# EAGLE design untitled (EAGLE 9.6.2)
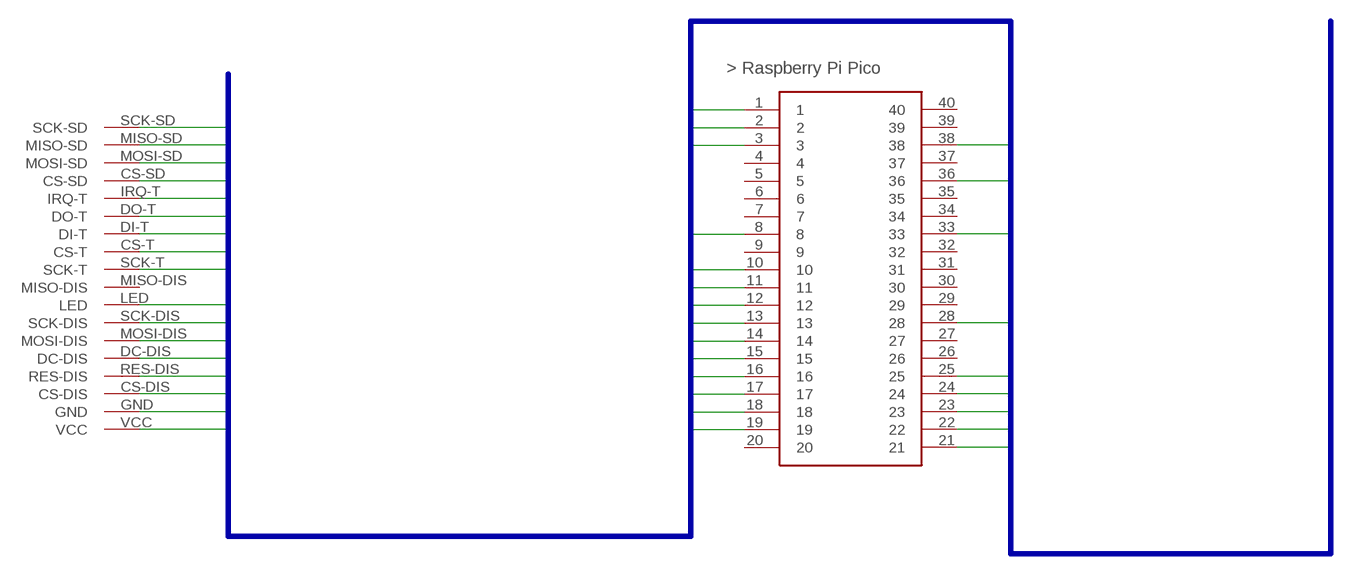
[diagram p0: schematic, sheet 1]

## Parts
U$1  ST7789  [TFT-2.8-SD]
U$3  PICO  [PICO_TH]

## Nets
3V: U$1.LED U$1.VCC U$3.36
CS-DIS: U$1.CS-DIS U$3.12
CS-SD: U$1.CS-SD U$3.22
CS-T: U$1.CS-T U$3.17
DC-DIS: U$1.DC-DIS U$3.11
GND: U$1.GND U$3.3 U$3.8 U$3.13 U$3.18 U$3.23 U$3.28 U$3.33 U$3.38
IRQ-T: U$1.IRQ-T U$3.19
MISO-DIS: U$1.DO-T U$3.16
MISO-SD: U$1.MISO-SD U$3.21
MOSI-DIS: U$1.DI-T U$1.MOSI-DIS U$3.15
MOSI-SD: U$1.MOSI-SD U$3.25
RES-DIS: U$1.RES-DIS U$3.10
RX: U$3.2
SCK-DIS: U$1.SCK-DIS U$1.SCK-T U$3.14
SCK-SD: U$1.SCK-SD U$3.24
TX: U$3.1
Unconnected: U$1.MISO-DIS U$3.4 U$3.5 U$3.6 U$3.7 U$3.9 U$3.20 U$3.26 U$3.27 U$3.29 U$3.30 U$3.31 U$3.32 U$3.34 U$3.35 U$3.37 U$3.39 U$3.40

## Buses
3V,5V,12V,CS-DIS,CS-SD,CS-T,D0-T,DC-DIS,DI-T,EN,GND,IRQ-T,LED,MISO-DIS,MISO-SD,MOSI-DIS,MOSI-SD,PWM,RES-DIS,RX,SCK-DIS,SCK-SD,TX,XA+,XA-,XB+,XB-,X-DIR,X-STEP,YA+,YA-,YB+,YB-,Y-DIR,Y-STEP

## Library data of the parts
U$1 = adafruit:ST7789
U$3 = pipico:PICO

## Board
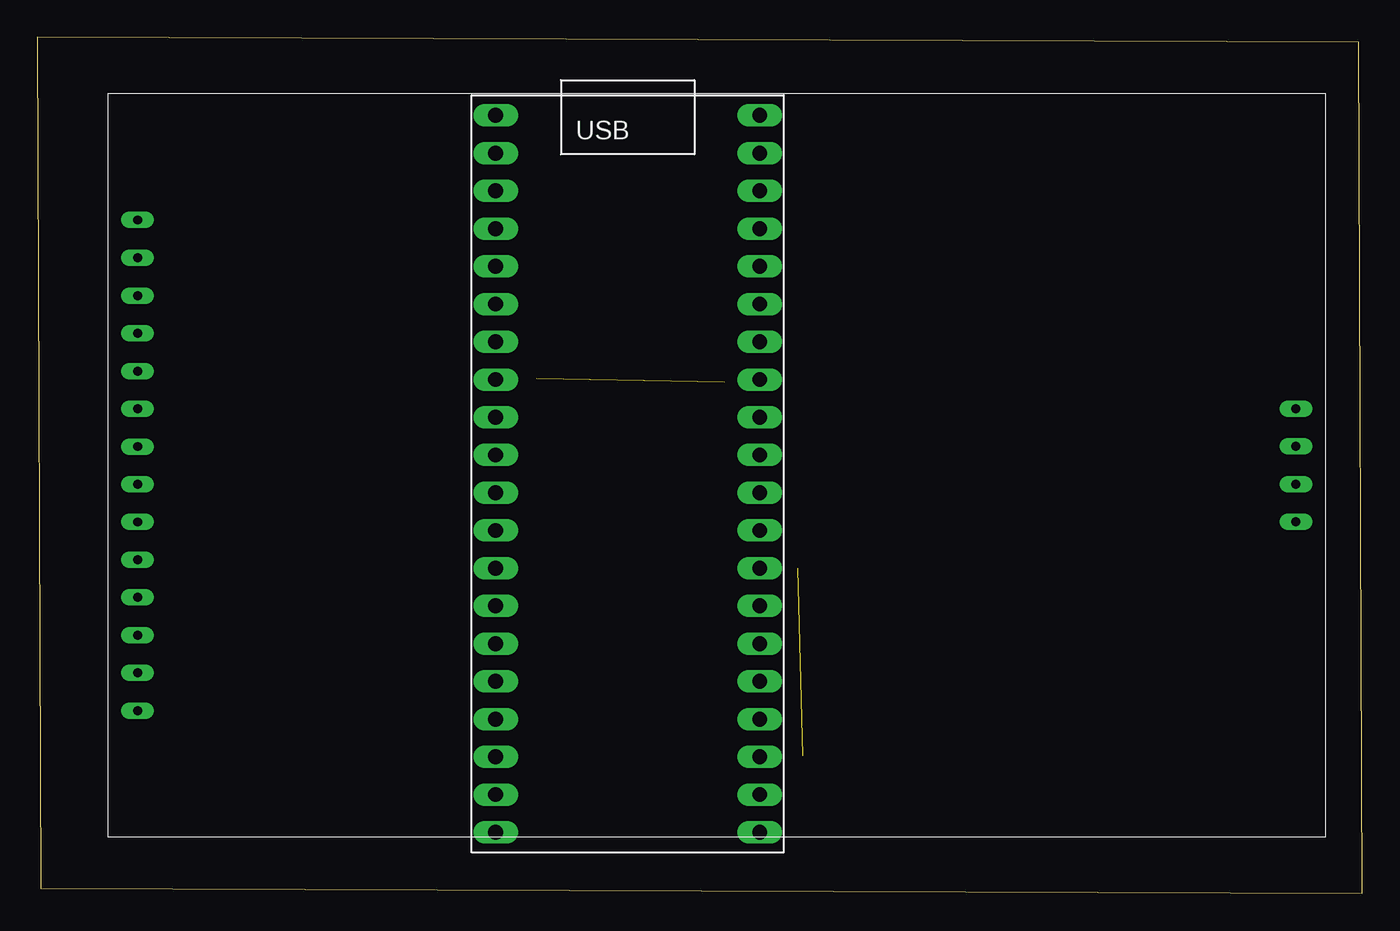
[diagram p1: board, top side]
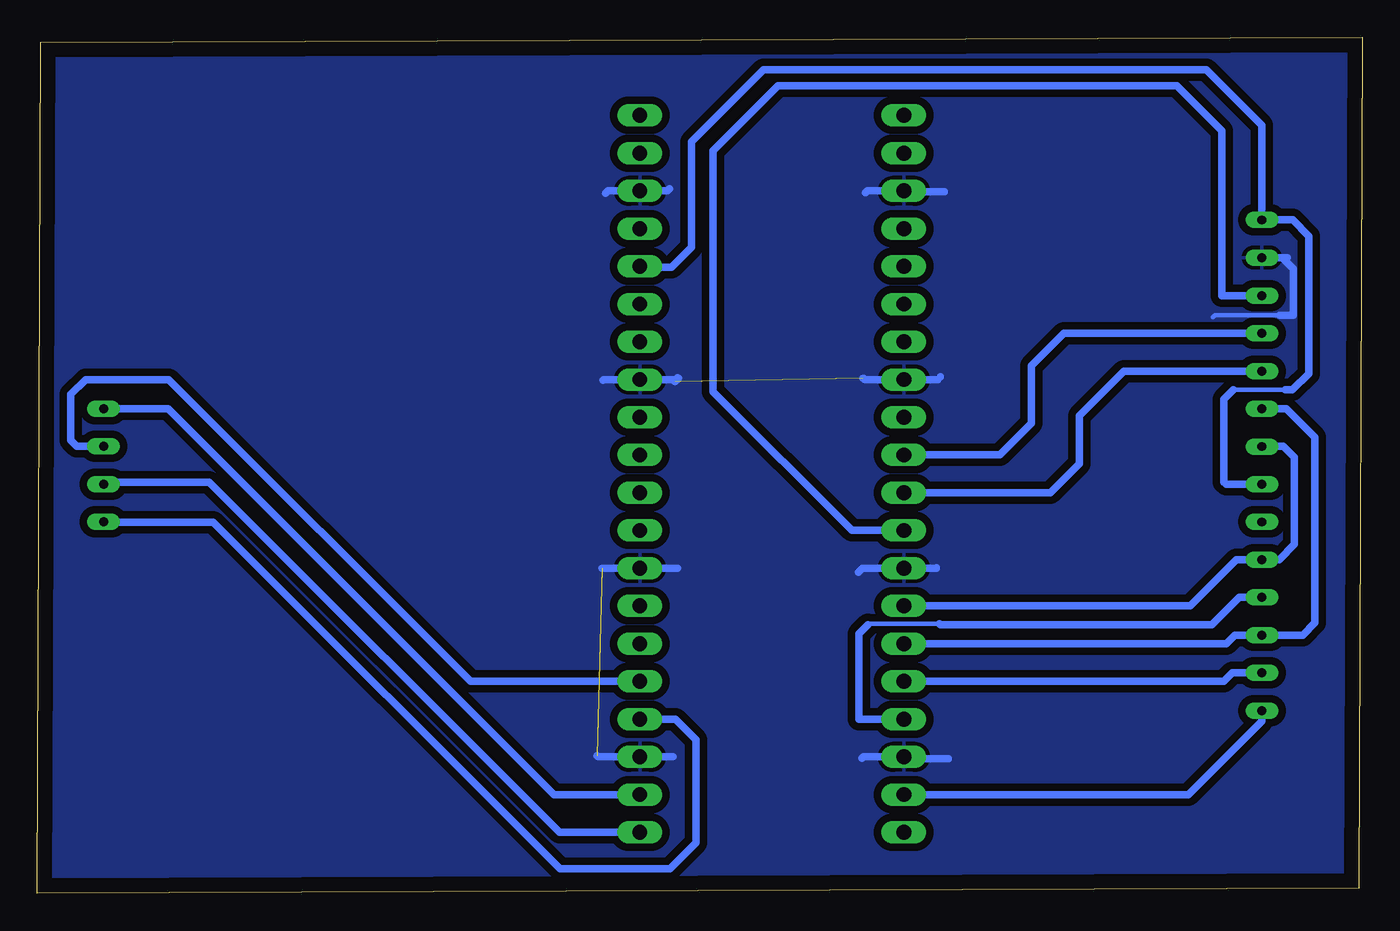
[diagram p2: board, bottom side, seen from below]

Size 89.25 x 57.65 mm. Coordinates in mm from the lower left corner, seen from the top.
Outline: 0.26,0.35 89.25,0 88.99,57.3 0,57.65 0.26,0.35
Copper layers (1*16): Top 0.035mm / dielectric 1.5mm / Bottom 0.035mm
Design rules "default *": minimum track width 6mil, minimum drill 0.35mm, track to track 20mil, track to pad 40mil, pad to pad 6mil, via to via 6mil, smd to smd 6mil, copper to edge 40mil, drill to drill 6mil, minimum pad ring 10mil, minimum via ring 8mil, stop-mask expansion 4mil, vias tented up to drill 0mil, thermal gap 10mil

### Footprints (pad centres in the part's own frame; a part is rotated, then mirrored left to right if it is on the bottom)
TFT-2.8-SD = drill 0.6 long: CS-DIS 13.58,2; CS-SD 21.19,80; CS-T 33.9,2; DC-DIS 18.66,2; DI-T 36.44,2; DO-T 38.98,2; GND 11.03,2; IRQ-T 41.52,2; LED 26.28,2; MISO-DIS 28.82,2; MISO-SD 26.27,80; MOSI-DIS 21.2,2; MOSI-SD 23.73,80; RES-DIS 16.12,2; SCK-DIS 23.74,2; SCK-SD 28.81,80; SCK-T 31.36,2; VCC 8.49,2
PICO_TH = drill 1 long: 1 -8.55,24.03; 2 -8.55,21.49; 3 -8.55,18.95; 4 -8.55,16.41; 5 -8.55,13.87; 6 -8.55,11.33; 7 -8.55,8.79; 8 -8.55,6.25; 9 -8.55,3.71; 10 -8.55,1.17; 11 -8.55,-1.37; 12 -8.55,-3.91; 13 -8.55,-6.45; 14 -8.55,-8.99; 15 -8.55,-11.53; 16 -8.55,-14.07; 17 -8.55,-16.61; 18 -8.55,-19.15; 19 -8.55,-21.69; 20 -8.55,-24.23; 21 9.23,-24.23; 22 9.23,-21.69; 23 9.23,-19.15; 24 9.23,-16.61; 25 9.23,-14.07; 26 9.23,-11.53; 27 9.23,-8.99; 28 9.23,-6.45; 29 9.23,-3.91; 30 9.23,-1.37; 31 9.23,1.17; 32 9.23,3.71; 33 9.23,6.25; 34 9.23,8.79; 35 9.23,11.33; 36 9.23,13.87; 37 9.23,16.41; 38 9.23,18.95; 39 9.23,21.49; 40 9.23,24.03

### Placement (x,y rotation side)
U$1  4.77,53.83 270 top
U$3  39.43,28.35 0 top

### Tracks (layer width: path | path; a pad name or v marks a point on that pad's centre or on a via)
3V
  Bottom 0.305: 8.68,33.9 5.2,33.9
  Bottom 0.508: U$3.36 48.59,42.15 46.54,42.15 45.19,43.5 45.19,50.61 40.35,55.45 10.51,55.45 6.77,51.71 U$1.VCC 4.7,45.34 3.62,44.26 3.62,35 4.72,33.9 5.2,33.9 | U$1.LED 9.18,27.55 9.32,27.69 9.32,33.26 8.68,33.9
CS-DIS
  Bottom 0.508: U$3.12 34.37,24.44 43.72,33.79 43.72,50 39.35,54.37 12.48,54.37 9.46,51.35 9.46,40.25 U$1.CS-DIS
CS-SD
  Bottom 0.508: U$3.22 54.45,6.66 80.43,32.64 U$1.CS-SD
CS-T
  Bottom 0.305: 28.47,18.15 29.62,18.15 33.24,18.15 33.3,18.09
  Bottom 0.508: U$1.CS-T 8.29,19.93 10.13,18.09 28.41,18.09 28.47,18.15 | U$3.17 33.91,11.74 33.91,17.48 33.3,18.09
DC-DIS
  Bottom 0.508: U$1.DC-DIS 16.05,35.17 19.05,32.17 19.05,28.93 21,26.98 U$3.11
GND  (2 unrouted)
  Bottom 0.305: 10.07,38.79 9.93,38.93 5.57,38.93
  Bottom 0.508: 33.94,21.64 33.68,21.9 U$3.13 28.69,21.9 28.67,21.92 | 33.71,9.1 33.61,9.2 U$3.18 30.75,9.07 27.89,9.07 | 51.55,9.28 51.47,9.2 U$3.23 46.44,9.2 | 6.8,42.83 U$1.GND 5.39,42.8 | 5.39,42.8 5.07,42.8 | 33.45,47.19 33.34,47.3 U$3.3 30.82,47.24 28.15,47.24 | 46.65,47.44 46.79,47.3 U$3.38 50.8,47.3 50.96,47.14 | 46.29,34.45 46.06,34.67 46.11,34.72 46.23,34.6 U$3.33 51.1,34.6 51.14,34.56 | 33.64,34.69 33.6,34.69 33.51,34.6 U$3.8 28.58,34.6 28.41,34.77 | 51.2,21.91 51.19,21.9 U$3.28 46.13,21.9 46.12,21.91 | 5.39,42.8 4.65,42.06 4.65,38.93 5.57,38.93
  pour Bottom: 0.04,0.02 -0.08,57.48 88.89,57.75 89,0.3
IRQ-T
  Bottom 0.508: U$3.19 11.71,6.66 6.77,11.6 U$1.IRQ-T
MISO-DIS
  Bottom 0.508: U$1.DO-T 8.75,14.85 9.32,14.28 U$3.16
MISO-SD
  Bottom 0.305: 84.48,27.85 84.63,27.7 U$1.MISO-SD
  Bottom 0.508: U$3.21 54.07,4.12 77.65,27.7 84.63,27.7
MOSI-DIS
  Bottom 0.508: U$1.DI-T 8.59,17.39 9.16,16.82 U$3.15 | 6.85,17.43 6.81,17.43 U$1.DI-T | U$1.DI-T 4.03,17.39 3.21,18.21 3.21,30.71 5.13,32.63 U$1.MOSI-DIS
MOSI-SD
  Bottom 0.305: 84.73,30.14 U$1.MOSI-SD
  Bottom 0.508: U$3.25 60.07,14.28 80.38,34.59 85.99,34.59 86.98,33.6 86.99,30.52 86.57,30.1 U$1.MOSI-SD
RES-DIS
  Bottom 0.508: U$1.RES-DIS 20.11,37.71 22.29,35.53 22.29,31.64 24.41,29.52 U$3.10
SCK-DIS
  Bottom 0.508: U$3.14 11.6,19.36 8.49,22.47 U$1.SCK-T 5.61,22.47 4.58,23.5 4.58,29.37 5.33,30.12 6.8,30.12 U$1.SCK-DIS
SCK-SD
  Bottom 0.305: U$1.SCK-SD 84.67,25.02 84.62,25.07
  Bottom 0.508: U$3.24 46.25,11.74 44.87,10.36 44.87,3.43 46.64,1.66 54.04,1.66 77.38,25 84.79,25 | 85.42,25 84.79,25 | 84.79,25 U$1.SCK-SD